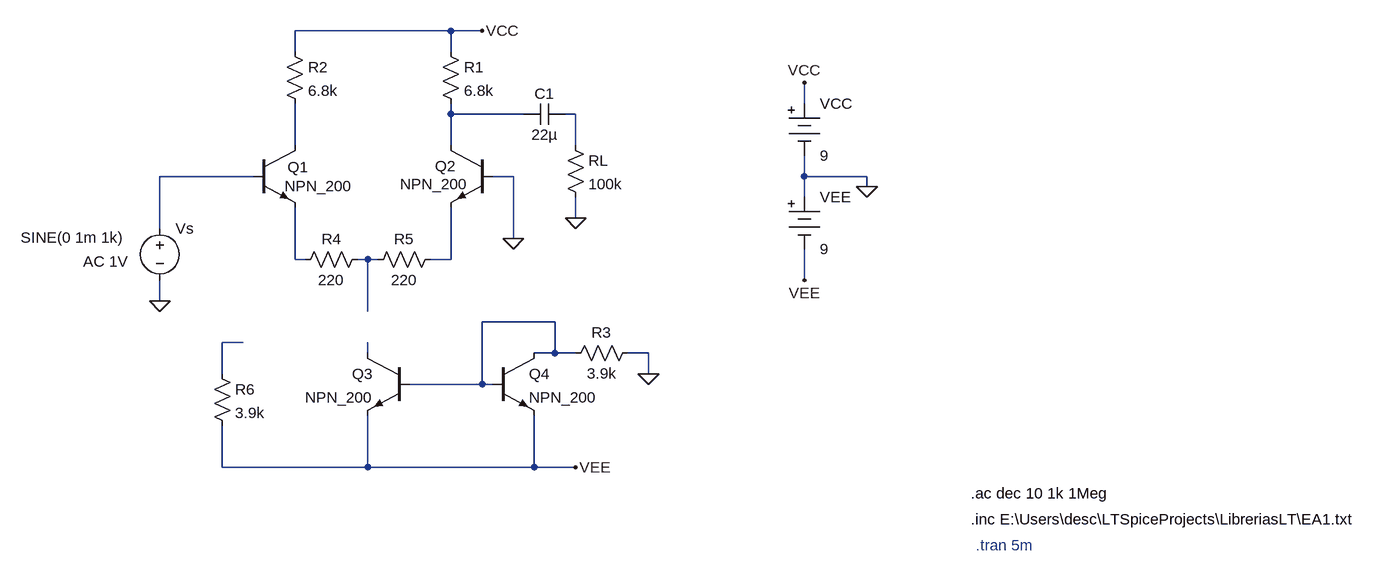
[diagram p0: schematic Circuito TP2.asc]
Circuito TP2.asc, the LTspice schematic file:
Version 4
SHEET 1 1824 680
WIRE 368 -208 128 -208
WIRE 416 -208 368 -208
WIRE 128 -176 128 -208
WIRE 368 -176 368 -208
WIRE 912 -96 912 -128
WIRE 368 -80 368 -96
WIRE 480 -80 368 -80
WIRE 560 -80 544 -80
WIRE 128 -32 128 -96
WIRE 368 -32 368 -80
WIRE 560 -32 560 -80
WIRE 64 16 -80 16
WIRE 464 16 432 16
WIRE 912 16 912 -16
WIRE 1008 16 912 16
WIRE 1008 32 1008 16
WIRE 912 48 912 16
WIRE 560 80 560 48
WIRE -80 96 -80 16
WIRE 464 112 464 16
WIRE 128 144 128 64
WIRE 144 144 128 144
WIRE 240 144 224 144
WIRE 256 144 240 144
WIRE 368 144 368 64
WIRE 368 144 336 144
WIRE 912 176 912 128
WIRE -80 208 -80 176
WIRE 240 224 240 144
WIRE 528 240 416 240
WIRE 48 272 16 272
WIRE 240 288 240 272
WIRE 528 288 528 240
WIRE 528 288 496 288
WIRE 560 288 528 288
WIRE 672 288 640 288
WIRE 16 320 16 272
WIRE 672 320 672 288
WIRE 416 336 416 240
WIRE 416 336 304 336
WIRE 432 336 416 336
WIRE 16 464 16 400
WIRE 240 464 240 384
WIRE 240 464 16 464
WIRE 496 464 496 384
WIRE 496 464 240 464
WIRE 560 464 496 464
FLAG 1008 32 0
FLAG 912 -128 VCC
FLAG 912 176 VEE
FLAG 416 -208 VCC
FLAG 560 464 VEE
FLAG 672 320 0
FLAG -80 208 0
FLAG 464 112 0
FLAG 560 80 0
SYMBOL npn 64 -32 R0
WINDOW 3 48 63 Left 2
WINDOW 0 53 34 Left 2
SYMATTR Value NPN_200
SYMATTR InstName Q1
SYMBOL npn 432 -32 M0
WINDOW 3 38 60 Left 2
SYMATTR Value NPN_200
SYMATTR InstName Q2
SYMBOL npn 304 288 M0
SYMATTR InstName Q3
SYMATTR Value NPN_200
SYMBOL npn 432 288 R0
SYMATTR InstName Q4
SYMATTR Value NPN_200
SYMBOL res 656 272 R90
WINDOW 0 0 56 VBottom 2
WINDOW 3 32 56 VTop 2
SYMATTR InstName R3
SYMATTR Value 3.9k
SYMBOL Misc\\battery 912 -112 R0
WINDOW 123 0 0 Left 0
WINDOW 39 0 0 Left 0
SYMATTR InstName VCC
SYMATTR Value 9
SYMBOL Misc\\battery 912 32 R0
WINDOW 123 0 0 Left 0
WINDOW 39 0 0 Left 0
SYMATTR InstName VEE
SYMATTR Value 9
SYMBOL voltage -80 80 R0
WINDOW 123 -118 67 Left 2
WINDOW 39 0 0 Left 2
WINDOW 3 -214 30 Left 2
SYMATTR Value2 AC 1V
SYMATTR InstName Vs
SYMATTR Value SINE(0 1m 1k)
SYMBOL res 544 -48 R0
SYMATTR InstName RL
SYMATTR Value 100k
SYMBOL cap 544 -96 R90
WINDOW 0 0 32 VBottom 2
WINDOW 3 32 32 VTop 2
SYMATTR InstName C1
SYMATTR Value 22µ
SYMBOL res 352 -192 R0
SYMATTR InstName R1
SYMATTR Value 6.8k
SYMBOL res 112 -192 R0
SYMATTR InstName R2
SYMATTR Value 6.8k
SYMBOL res 240 128 R90
WINDOW 0 0 56 VBottom 2
WINDOW 3 32 56 VTop 2
SYMATTR InstName R4
SYMATTR Value 220
SYMBOL res 352 128 R90
WINDOW 0 0 56 VBottom 2
WINDOW 3 32 56 VTop 2
SYMATTR InstName R5
SYMATTR Value 220
SYMBOL res 0 304 R0
SYMATTR InstName R6
SYMATTR Value 3.9k
TEXT 1168 544 Left 2 !.inc E:\\Users\\desc\\LTSpiceProjects\\LibreriasLT\\EA1.txt
TEXT 1176 584 Left 2 ;.tran 5m
TEXT 1168 504 Left 2 !.ac dec 10 1k 1Meg

The netlist it stands for:
* Circuito TP2.asc
Q1 N003 N004 N005 0 NPN_200
Q2 N001 0 N007 0 NPN_200
Q3 N010 N008 VEE 0 NPN_200
Q4 N008 N008 VEE 0 NPN_200
R3 0 N008 3.9k
VCC VCC 0 9
VEE 0 VEE 9
Vs N004 0 SINE(0 1m 1k) AC 1V
RL N002 0 100k
C1 N002 N001 22µ
R1 VCC N001 6.8k
R2 VCC N003 6.8k
R4 N006 N005 220
R5 N007 N006 220
R6 N009 VEE 3.9k
.model NPN NPN
.model PNP PNP
.lib standard.bjt
.inc E:\Users\desc\LTSpiceProjects\LibreriasLT\EA1.txt
* .tran 5m
.ac dec 10 1k 1Meg
.backanno
.end